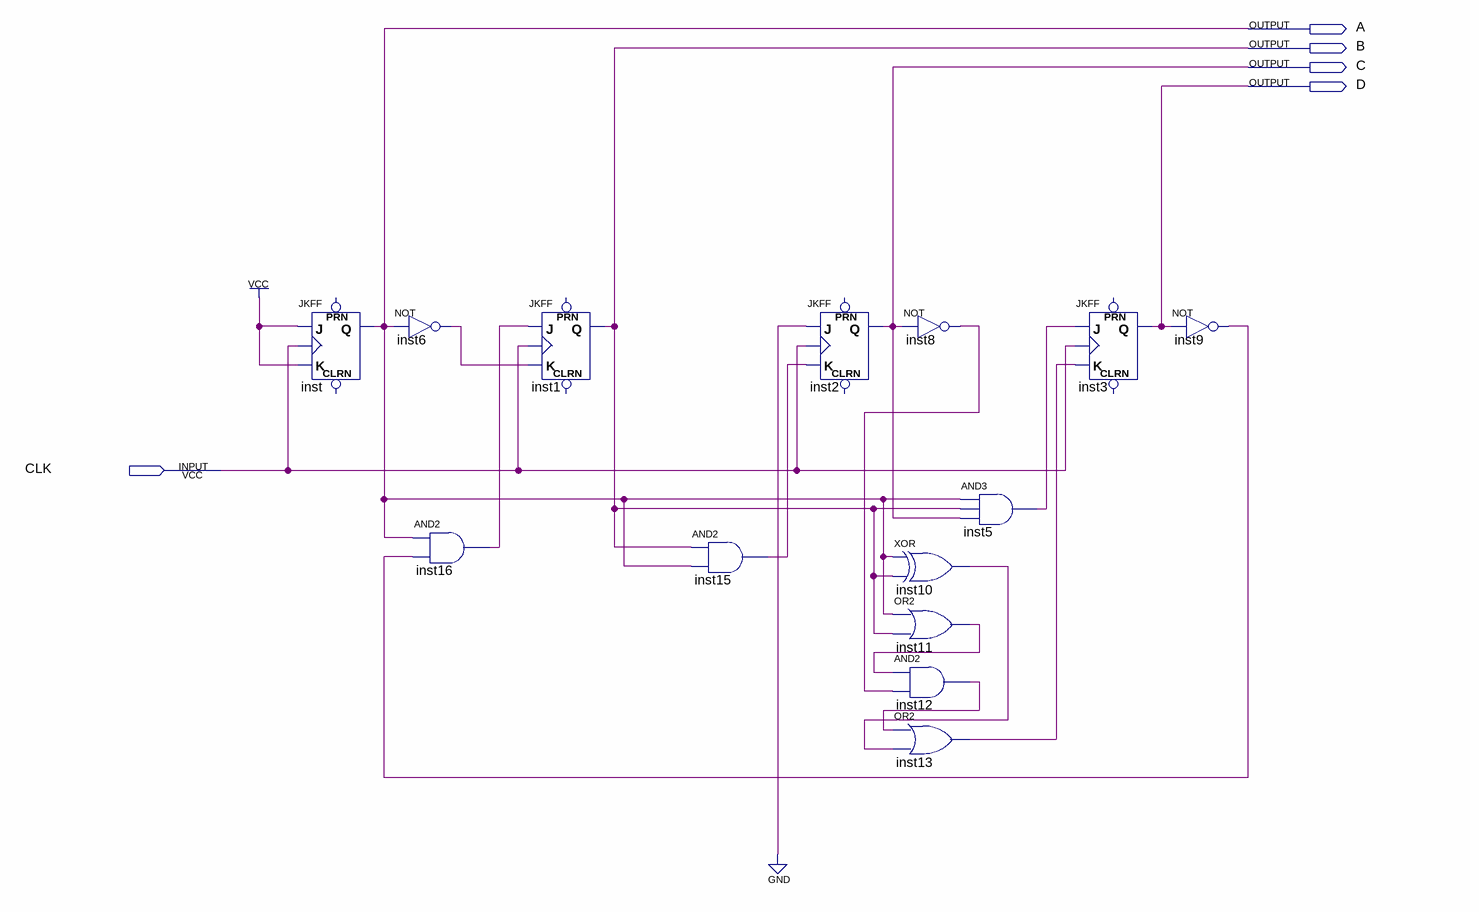
[diagram p0: schematic sheet]
// Quartus schematic 10counter.bdf as structural Verilog: 14 symbols, 5 pins
module \10counter  (
  input  CLK,
  output A,
  output B,
  output C,
  output D
);

  wire inst5_out, inst6_out, inst8_out, inst9_out, inst10_out, inst11_out, inst12_out, inst13_out,
       inst15_out, inst16_out;

  JKFF inst (.K(1'b1), .J(1'b1), .CLK(CLK), .Q(A));  // open: PRN, CLRN
  not inst6 (inst6_out, A);
  and inst16 (inst16_out, A, inst9_out);
  JKFF inst1 (.K(inst6_out), .J(inst16_out), .CLK(CLK), .Q(B));  // open: PRN, CLRN
  and inst15 (inst15_out, B, A);
  JKFF inst2 (.K(inst15_out), .J(1'b0), .CLK(CLK), .Q(C));  // open: PRN, CLRN
  not inst8 (inst8_out, C);
  xor inst10 (inst10_out, A, B);
  or inst11 (inst11_out, A, B);
  and inst12 (inst12_out, inst11_out, inst8_out);
  or inst13 (inst13_out, inst12_out, inst10_out);
  and inst5 (inst5_out, A, B, C);
  JKFF inst3 (.K(inst13_out), .J(inst5_out), .CLK(CLK), .Q(D));  // open: PRN, CLRN
  not inst9 (inst9_out, D);
endmodule
